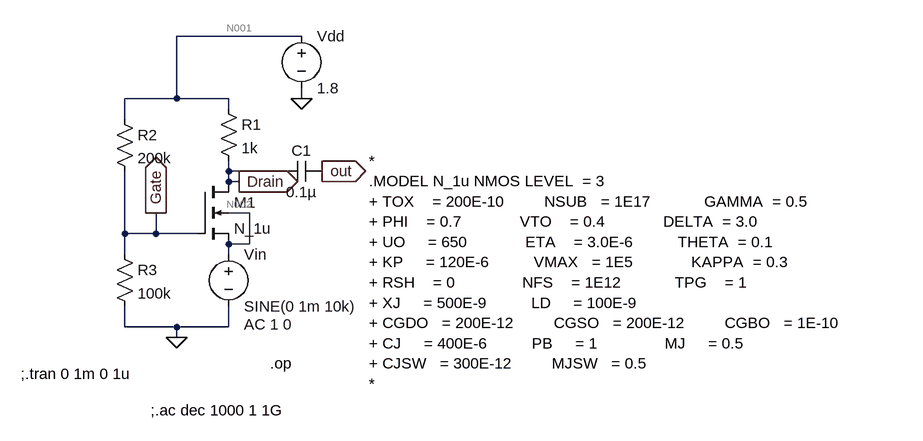
[diagram p0: schematic common gate.asc]
common gate.asc, the LTspice schematic file:
Version 4
SHEET 1 1292 680
WIRE 336 -128 144 -128
WIRE 144 -32 144 -128
WIRE 144 -32 64 -32
WIRE 224 -32 144 -32
WIRE 336 -32 336 -48
WIRE 224 -16 224 -32
WIRE 64 0 64 -32
WIRE 224 80 224 64
WIRE 304 80 224 80
WIRE 224 96 224 80
WIRE 240 96 224 96
WIRE 256 144 224 144
WIRE 64 176 64 80
WIRE 112 176 112 144
WIRE 112 176 64 176
WIRE 176 176 112 176
WIRE 256 192 256 144
WIRE 256 192 224 192
WIRE 64 208 64 176
WIRE 224 208 224 192
WIRE 64 320 64 288
WIRE 144 320 64 320
WIRE 224 320 224 288
WIRE 224 320 144 320
WIRE 144 336 144 320
FLAG 336 -32 0
FLAG 144 336 0
FLAG 368 80 out
IOPIN 368 80 Out
FLAG 112 144 Gate
IOPIN 112 144 Out
FLAG 240 96 Drain
IOPIN 240 96 Out
SYMBOL nmos4 176 96 R0
SYMATTR InstName M1
SYMATTR Value N_1u
SYMATTR Value2 l=1u w=416u
SYMBOL voltage 224 192 R0
WINDOW 123 24 124 Left 2
WINDOW 39 0 0 Left 0
SYMATTR Value2 AC 1 0
SYMATTR InstName Vin
SYMATTR Value SINE(0 1m 10k)
SYMBOL res 208 -32 R0
SYMATTR InstName R1
SYMATTR Value 1k
SYMBOL voltage 336 -144 R0
WINDOW 123 0 0 Left 0
WINDOW 39 0 0 Left 0
SYMATTR InstName Vdd
SYMATTR Value 1.8
SYMBOL res 48 -16 R0
SYMATTR InstName R2
SYMATTR Value 200k
SYMBOL res 48 192 R0
SYMATTR InstName R3
SYMATTR Value 100k
SYMBOL cap 368 64 R90
WINDOW 0 0 32 VBottom 2
WINDOW 3 32 32 VTop 2
SYMATTR InstName C1
SYMATTR Value 0.1µ
TEXT 440 64 Left 2 !*                                                                   \n.MODEL N_1u NMOS LEVEL  = 3                  \n+ TOX    = 200E-10         NSUB   = 1E17            GAMMA  = 0.5          \n+ PHI    = 0.7             VTO    = 0.4             DELTA  = 3.0         \n+ UO     = 650             ETA    = 3.0E-6          THETA  = 0.1          \n+ KP     = 120E-6          VMAX   = 1E5             KAPPA  = 0.3                \n+ RSH    = 0               NFS    = 1E12            TPG    = 1                  \n+ XJ     = 500E-9          LD     = 100E-9                 \n+ CGDO   = 200E-12         CGSO   = 200E-12         CGBO   = 1E-10              \n+ CJ     = 400E-6          PB     = 1               MJ     = 0.5           \n+ CJSW   = 300E-12         MJSW   = 0.5                                  \n*
TEXT -96 392 Left 2 !;.tran 0 1m 0 1u
TEXT 288 376 Left 2 !.op
TEXT 104 448 Left 2 !;.ac dec 1000 1 1G

The netlist it stands for:
* common gate.asc
M1 Drain Gate N002 N002 N_1u l=1u w=416u
Vin N002 0 SINE(0 1m 10k) AC 1 0
R1 N001 Drain 1k
Vdd N001 0 1.8
R2 N001 Gate 200k
R3 Gate 0 100k
C1 out Drain 0.1µ
.model NMOS NMOS
.model PMOS PMOS
.lib standard.mos
*
.MODEL N_1u NMOS LEVEL  = 3
+ TOX    = 200E-10         NSUB   = 1E17            GAMMA  = 0.5
+ PHI    = 0.7             VTO    = 0.4             DELTA  = 3.0
+ UO     = 650             ETA    = 3.0E-6          THETA  = 0.1
+ KP     = 120E-6          VMAX   = 1E5             KAPPA  = 0.3
+ RSH    = 0               NFS    = 1E12            TPG    = 1
+ XJ     = 500E-9          LD     = 100E-9
+ CGDO   = 200E-12         CGSO   = 200E-12         CGBO   = 1E-10
+ CJ     = 400E-6          PB     = 1               MJ     = 0.5
+ CJSW   = 300E-12         MJSW   = 0.5
*
;.tran 0 1m 0 1u
.op
;.ac dec 1000 1 1G
.backanno
.end

* Results of the author's LTspice run, read from the files saved beside the schematic
* Operating Point:
*   V(drain) = 299.9 mV
*   V(gate) = 600 mV
*   V(n002) = 0 V
*   V(n001) = 1.8 V
*   V(out) = 29.99 nV
*   Id(M1) = 1.5 mA
*   Ig(M1) = 0 A
*   Ib(M1) = -309.9 fA
*   Is(M1) = -1.5 mA
*   I(C1) = 0 A
*   I(R3) = 6 µA
*   I(R2) = 6 µA
*   I(R1) = 1.5 mA
*   I(Vdd) = -1.506 mA
*   I(Vin) = 1.5 mA
* From the log:
*   Semiconductor Device Operating Points:
*                           --- MOSFET Transistors ---
*   Name:          m1
*   Model:        n_1u
*   Id:          1.50e-03
*   Vgs:         6.00e-01
*   Vds:         3.00e-01
*   Vbs:         0.00e+00
*   Vth:         4.02e-01
*   Vdsat:       2.05e-01
*   Gm:          1.06e-02
*   Gds:         2.92e-04
*   Gmb:         2.41e-03
*   Cbd:         0.00e+00
*   Cbs:         0.00e+00
*   Cgsov:       8.32e-14
*   Cgdov:       8.32e-14
*   Cgbov:       8.00e-17
*   Cgs:         3.83e-13
*   Cgd:         0.00e+00
*   Cgb:         0.00e+00